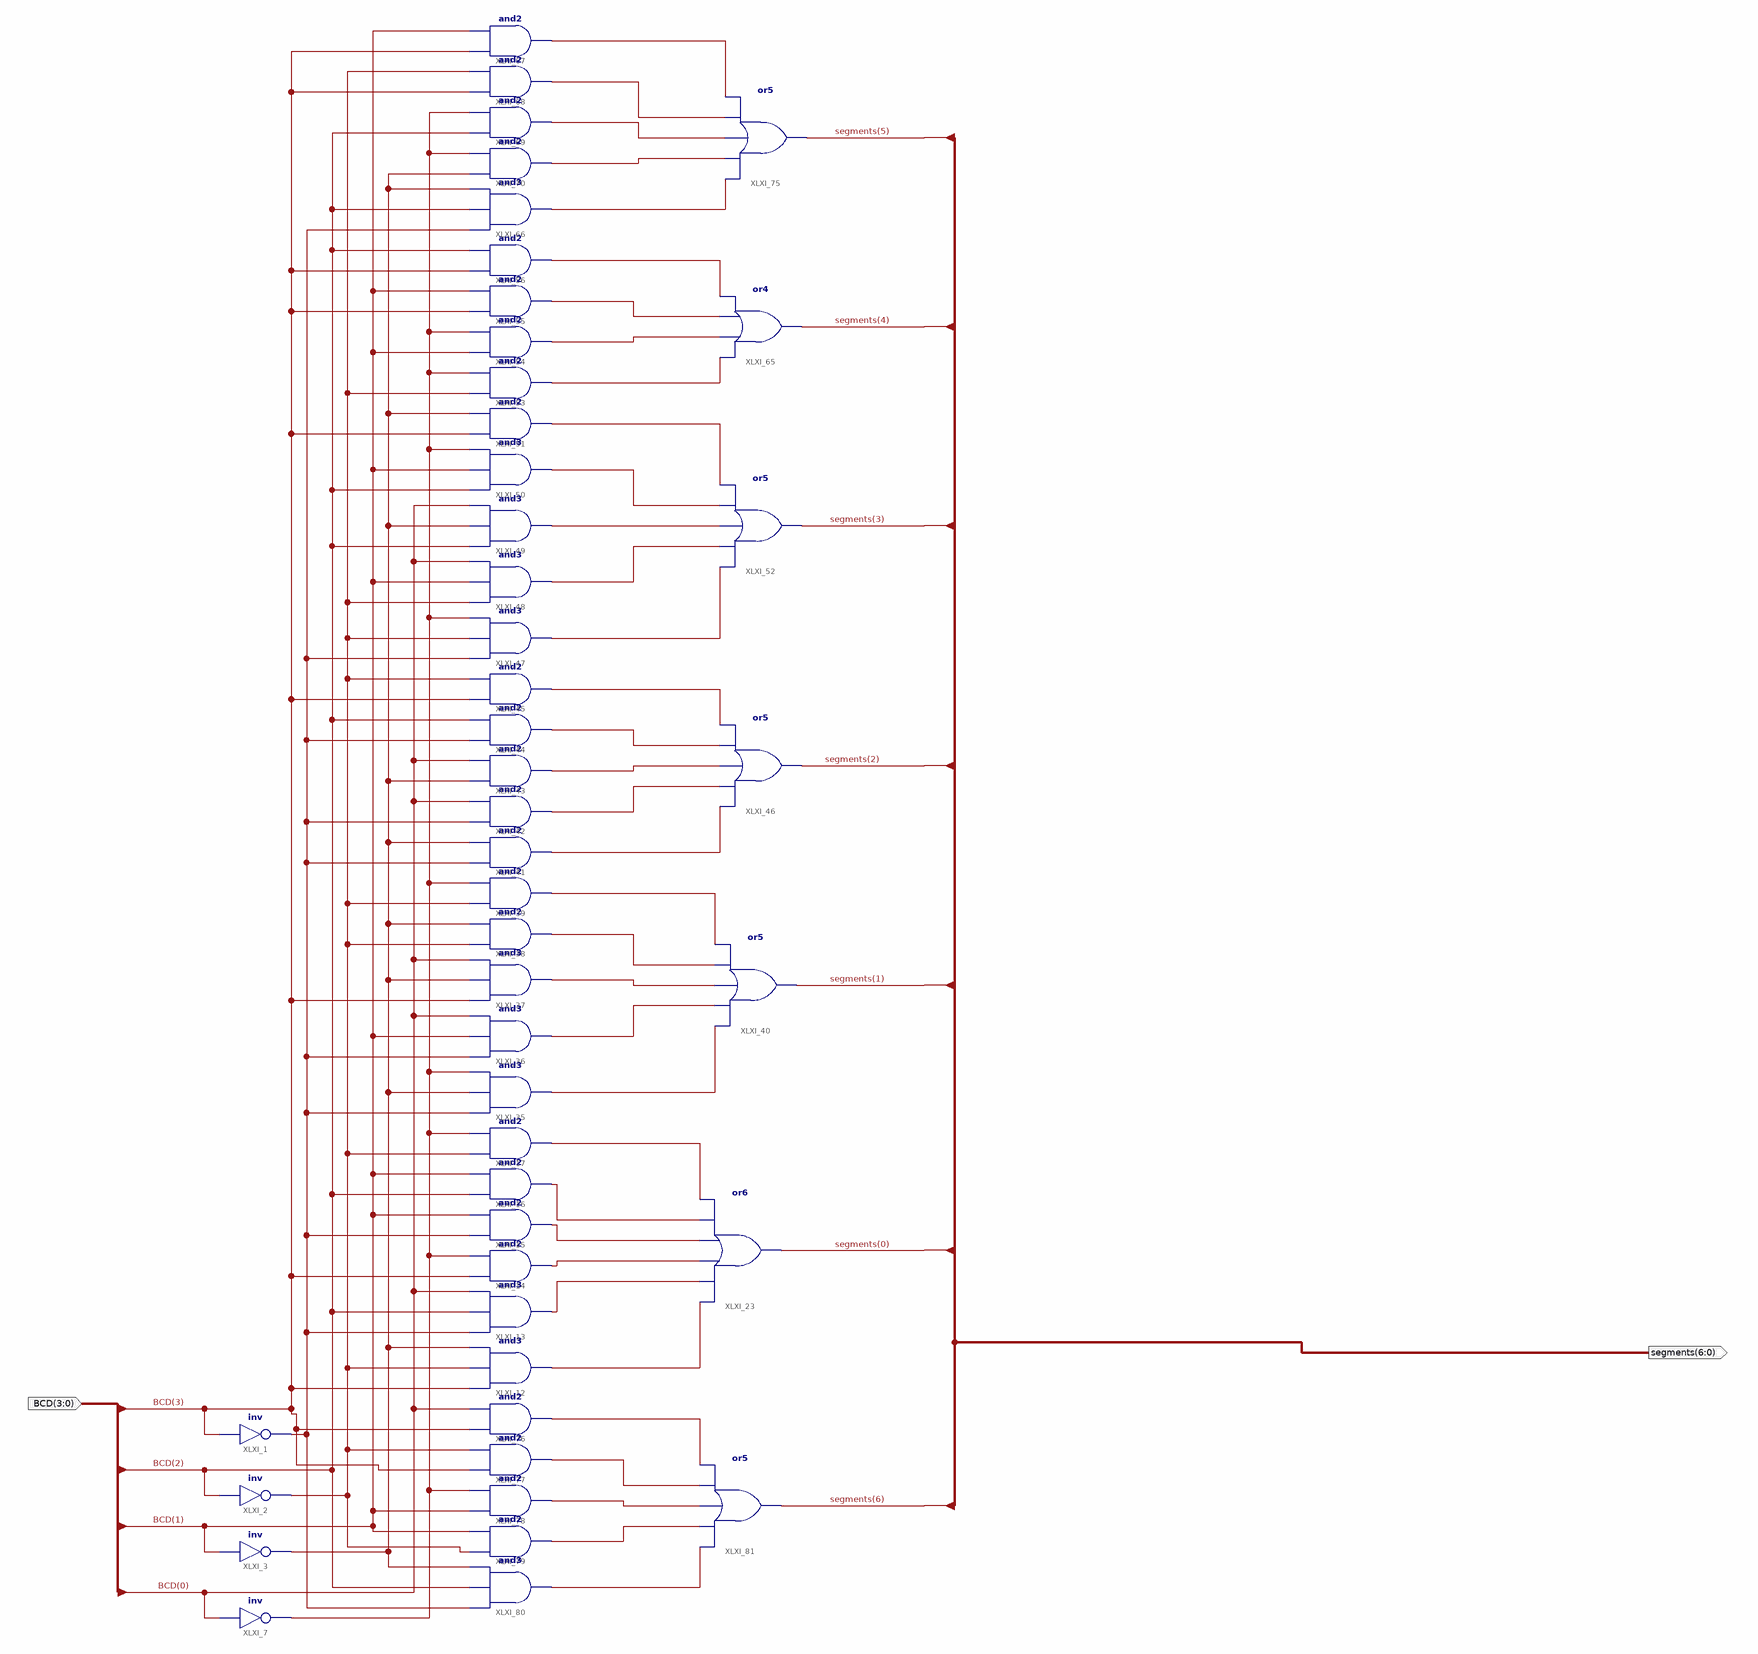
[diagram p0: schematic sheet 1]
// Xilinx ISE schematic HEX_decoder.sch (spartan6) as structural Verilog: 46 symbols, 2 ports
module HEX_decoder (
  input  [3:0] BCD,
  output [6:0] segments
);

  wire XLXN_11, XLXN_14, XLXN_28, XLXN_29, XLXN_30, XLXN_31, XLXN_32, XLXN_33, XLXN_61, XLXN_62, XLXN_63,
       XLXN_64, XLXN_65, XLXN_68, XLXN_69, XLXN_70, XLXN_71, XLXN_72, XLXN_73, XLXN_74, XLXN_75, XLXN_76,
       XLXN_77, XLXN_78, XLXN_79, XLXN_80, XLXN_81, XLXN_82, XLXN_83, XLXN_84, XLXN_85, XLXN_86, XLXN_94,
       XLXN_95, XLXN_96, XLXN_97, XLXN_98, XLXN_100, XLXN_105;

  not XLXI_1 (XLXN_11, BCD[3]);
  not XLXI_2 (XLXN_105, BCD[2]);
  not XLXI_3 (XLXN_100, BCD[1]);
  not XLXI_7 (XLXN_14, BCD[0]);
  and XLXI_12 (XLXN_28, BCD[3], XLXN_105, XLXN_100);
  and XLXI_13 (XLXN_29, XLXN_11, BCD[2], BCD[0]);
  and XLXI_14 (XLXN_30, BCD[3], XLXN_14);
  and XLXI_15 (XLXN_31, XLXN_11, BCD[1]);
  and XLXI_16 (XLXN_32, BCD[2], BCD[1]);
  and XLXI_17 (XLXN_33, XLXN_105, XLXN_14);
  or XLXI_23 (segments[0], XLXN_28, XLXN_29, XLXN_30, XLXN_31, XLXN_32, XLXN_33);
  and XLXI_35 (XLXN_65, XLXN_11, XLXN_100, XLXN_14);
  and XLXI_36 (XLXN_64, XLXN_11, BCD[1], BCD[0]);
  and XLXI_37 (XLXN_63, BCD[3], XLXN_100, BCD[0]);
  and XLXI_38 (XLXN_62, XLXN_105, XLXN_100);
  and XLXI_39 (XLXN_61, XLXN_105, XLXN_14);
  or XLXI_40 (segments[1], XLXN_65, XLXN_64, XLXN_63, XLXN_62, XLXN_61);
  and XLXI_41 (XLXN_72, XLXN_11, XLXN_100);
  and XLXI_42 (XLXN_71, XLXN_11, BCD[0]);
  and XLXI_43 (XLXN_70, XLXN_100, BCD[0]);
  and XLXI_44 (XLXN_69, XLXN_11, BCD[2]);
  and XLXI_45 (XLXN_68, BCD[3], XLXN_105);
  or XLXI_46 (segments[2], XLXN_72, XLXN_71, XLXN_70, XLXN_69, XLXN_68);
  and XLXI_47 (XLXN_77, XLXN_11, XLXN_105, XLXN_14);
  and XLXI_48 (XLXN_76, XLXN_105, BCD[1], BCD[0]);
  and XLXI_49 (XLXN_75, BCD[2], XLXN_100, BCD[0]);
  and XLXI_50 (XLXN_74, BCD[2], BCD[1], XLXN_14);
  and XLXI_51 (XLXN_73, BCD[3], XLXN_100);
  or XLXI_52 (segments[3], XLXN_77, XLXN_76, XLXN_75, XLXN_74, XLXN_73);
  and XLXI_56 (XLXN_78, BCD[3], BCD[2]);
  and XLXI_55 (XLXN_79, BCD[3], BCD[1]);
  and XLXI_54 (XLXN_80, BCD[1], XLXN_14);
  and XLXI_53 (XLXN_81, XLXN_105, XLXN_14);
  or XLXI_65 (segments[4], XLXN_81, XLXN_80, XLXN_79, XLXN_78);
  and XLXI_66 (XLXN_86, XLXN_11, BCD[2], XLXN_100);
  and XLXI_67 (XLXN_82, BCD[3], BCD[1]);
  and XLXI_68 (XLXN_83, BCD[3], XLXN_105);
  and XLXI_69 (XLXN_84, BCD[2], XLXN_14);
  and XLXI_70 (XLXN_85, XLXN_100, XLXN_14);
  or XLXI_75 (segments[5], XLXN_86, XLXN_85, XLXN_84, XLXN_83, XLXN_82);
  and XLXI_76 (XLXN_94, BCD[3], BCD[0]);
  and XLXI_77 (XLXN_95, BCD[3], XLXN_105);
  and XLXI_78 (XLXN_96, BCD[1], XLXN_14);
  and XLXI_79 (XLXN_97, XLXN_105, BCD[1]);
  and XLXI_80 (XLXN_98, XLXN_11, BCD[2], XLXN_100);
  or XLXI_81 (segments[6], XLXN_98, XLXN_97, XLXN_96, XLXN_95, XLXN_94);
endmodule
